# Altium project 功率检测模块.PrjPcb
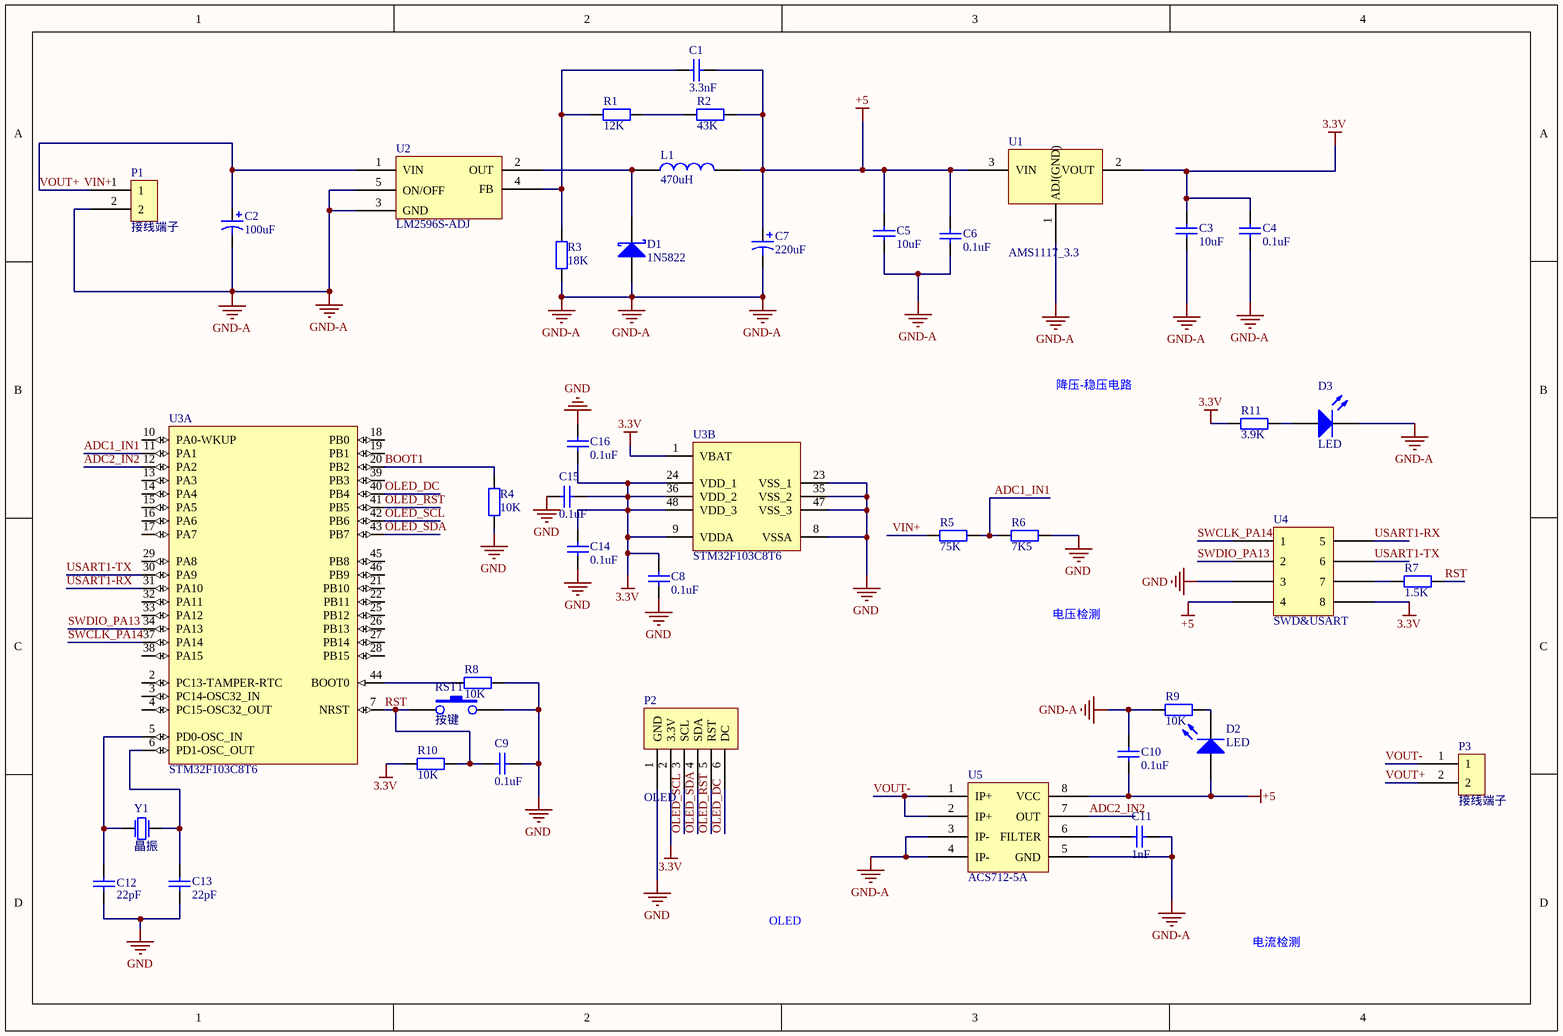
[diagram p0: 功率检测模块.SchDoc]
1 sheet, 41 parts. Net scope: global (net labels, ports and power ports of the same name join across sheets).
Board files: 功率检测模块.PcbDoc, PCB.PcbDoc

## Sheet 功率检测模块.SchDoc
size A4

### Parts
C1  3.3nF  [0805]
C2  100uF  [电解电容8*10.5]
C3  10uF  [0805]
C4  0.1uF  [0805]
C5  10uF  [0805]
C6  0.1uF  [0805]
C7  220uF  [电解电容10*10.5]
C8  0.1uF  [0805]
C9  0.1uF  [0805]
C10  0.1uF  [0805]
C11  1nF  [0805]
C12  22pF  [0805]
C13  22pF  [0805]
C14  0.1uF  [0805]
C15  0.1uF  [0805]
C16  0.1uF  [0805]
D1  1N5822  [SMA(DO-214AC)_S2]
D2  LED  [0805]
D3  LED  [0805]
L1  470uH  [电感]
P1  接线端子  [接线端子]
P2  OLED  [HDR6]
P3  接线端子  [接线端子]
R1  12K  [0805]
R2  43K  [0805]
R3  18K  [0805]
R4  10K  [0805]
R5  75K  [0805]
R6  7K5  [0805]
R7  1.5K  [0805]
R8  10K  [0805]
R9  10K  [0805]
R10  10K  [0805]
R11  3.9K  [0805]
RST1  按键  [SWT3*4]
U1  AMS1117_3.3  [SOT-223]
U2  LM2596S-ADJ  [TO-263-5]
U3  STM32F103C8T6  [STM-LQFP48_L]  (parts A,B of 2)
U4  SWD&USART  [HDR2X4]
U5  ACS712-5A  [SOP-8_208mil]
Y1  晶振  [5032_2P]

### Nets
3.3V: C3.2 C4.2 C8.2 C14.1 C15.2 C16.1 P2.2(3.3V) R10.1 R11.1 U1.2(VOUT) U3.1(VBAT) U3.9(VDDA) U3.24(VDD_1) U3.36(VDD_2) U3.48(VDD_3) U4.8
+5: C1.2 C5.2 C6.2 C7.1 C10.1 D2.1(A) L1.2 R2.2 U1.3(VIN) U4.4 U5.8(VCC)
GND: C8.1 C9.2 C12.1 C13.1 C14.2 C15.1 C16.2 P2.1(GND) R4.1 R6.1 R8.2 RST1.2 U3.8(VSSA) U3.23(VSS_1) U3.35(VSS_2) U3.47(VSS_3) U4.3
GND-A: C2.2 C3.1 C4.1 C5.1 C6.1 C7.2 C10.2 C11.2 D1.1(A) D3.2(K) P1.2 R3.1 R9.2 U1.1(ADJ(GND)) U2.3(GND) U2.5(ON/OFF) U5.3(IP-) U5.4(IP-) U5.5(GND)
ADC1_IN1: R5.2 R6.2 U3.11(PA1)
ADC2_IN2: U3.12(PA2) U5.7(OUT)
BOOT1: R4.2 U3.20(PB2)
OLED_DC: P2.6(DC) U3.40(PB4)
OLED_RST: P2.5(RST) U3.41(PB5)
OLED_SCL: P2.3(SCL) U3.42(PB6)
OLED_SDA: P2.4(SDA) U3.43(PB7)
RST: C9.1 R7.2 R10.2 RST1.1 U3.7(NRST)
SWCLK_PA14: U3.37(PA14) U4.1
SWDIO_PA13: U3.34(PA13) U4.2
USART1-RX: U3.31(PA10) U4.5
USART1-TX: U3.30(PA9) U4.6
VIN+: C2.1 P1.1 P3.2 R5.1 U2.1(VIN)  [also labelled VOUT+]
VOUT-: P3.1 U5.1(IP+) U5.2(IP+)
NetC1_1: C1.1 R1.1 R3.2 U2.4(FB)
NetC11_1: C11.1 U5.6(FILTER)
NetC12_2: C12.2 U3.5(PD0-OSC_IN) Y1.1(P1)
NetC13_2: C13.2 U3.6(PD1-OSC_OUT) Y1.2(P2)
NetD1_2: D1.2(K) L1.1 U2.2(OUT)
NetD2_2: D2.2(K) R9.1
NetD3_1: D3.1(A) R11.2
NetR1_2: R1.2 R2.1
NetR7_1: R7.1 U4.7
NetR8_1: R8.1 U3.44(BOOT0)

Not connected (* = marked no-connect by the designer): U3 2(PC13-TAMPER-RTC) 3(PC14-OSC32_IN) 4(PC15-OSC32_OUT) 10(PA0-WKUP) 13(PA3) 14(PA4) 15(PA5) 16(PA6) 17(PA7) 18(PB0) 19(PB1) 21(PB10) 22(PB11) 25(PB12) 26(PB13) 27(PB14) 28(PB15) 29(PA8) 32(PA11) 33(PA12) 38(PA15) 39(PB3) 45(PB8) 46(PB9)

### Notes on the sheet
- 降压-稳压电路
- 电压检测
- OLED
- 电流检测

### Library data of the parts
C1 C3-C6 C8-C16 = 电容
C2 C7 = 电解电容
L1 = 电感
P1 P3 = 接线端子: 螺旋式接线端子
R1-R11 = RES: 贴片电阻
U3 = STM32F103C8T6: ARM Cortex-M3 32-bit MCU, 64 KB Flash, 20 KB Internal RAM, 37 I/Os, 48-pin LQFP, -40 to 85 degC, Tray; A/D Converter: 2x12-bit (10 Channel); FLASH Size (Prog) (kB): 64; I/Os (High Current): 37; Internal RAM Size (kB): 20; Operating Frequency(F) (Processor speed) (MHz): 72; Supply Voltage(Vcc) min (V): 2; DatasheetVersion: Rev. 16; PackageVersion: Rev. 6, 06/2013; PackageReference: LQFP48; PackageDescription: 48-Pin Low Profile Quad Flat Package, 7 x 7 mm Body, 0.5 mm Pitch; Supplier 1: Digi-Key; Supplier Part Number 1: 497-6063-ND; Supplier 2: Farnell; Supplier Part Number 2: 1447637; Supplier 3: Newark; Supplier Part Number 3: 59M2182; Supplier 4: Newark; Supplier Part Number 4: 57P1222; Supplier 5: Mouser; Supplier Part Number 5: 511-STM32F103C8T6; Core: ARM Cortex-M3; Packing: Tray; Mounting Technology: Surface Mount; PartNumber: STM32F103C8T6; ComponentLink1Description: Manufacturer URL; ComponentLink1URL: http://www.st.com/web/en/home.html; ComponentLink2Description: Datasheet; ComponentLink2URL: http://www.st.com/st-web-ui/static/active/en/resource/technical/document/datasheet/CD00161566.pdf; ComponentLink3Description: Package Specification; ComponentLink3URL: http://www.st.com/st-web-ui/static/active/en/resource/technical/document/datasheet/DM00058181.pdf